# EAGLE design main (EAGLE 7.1.0)
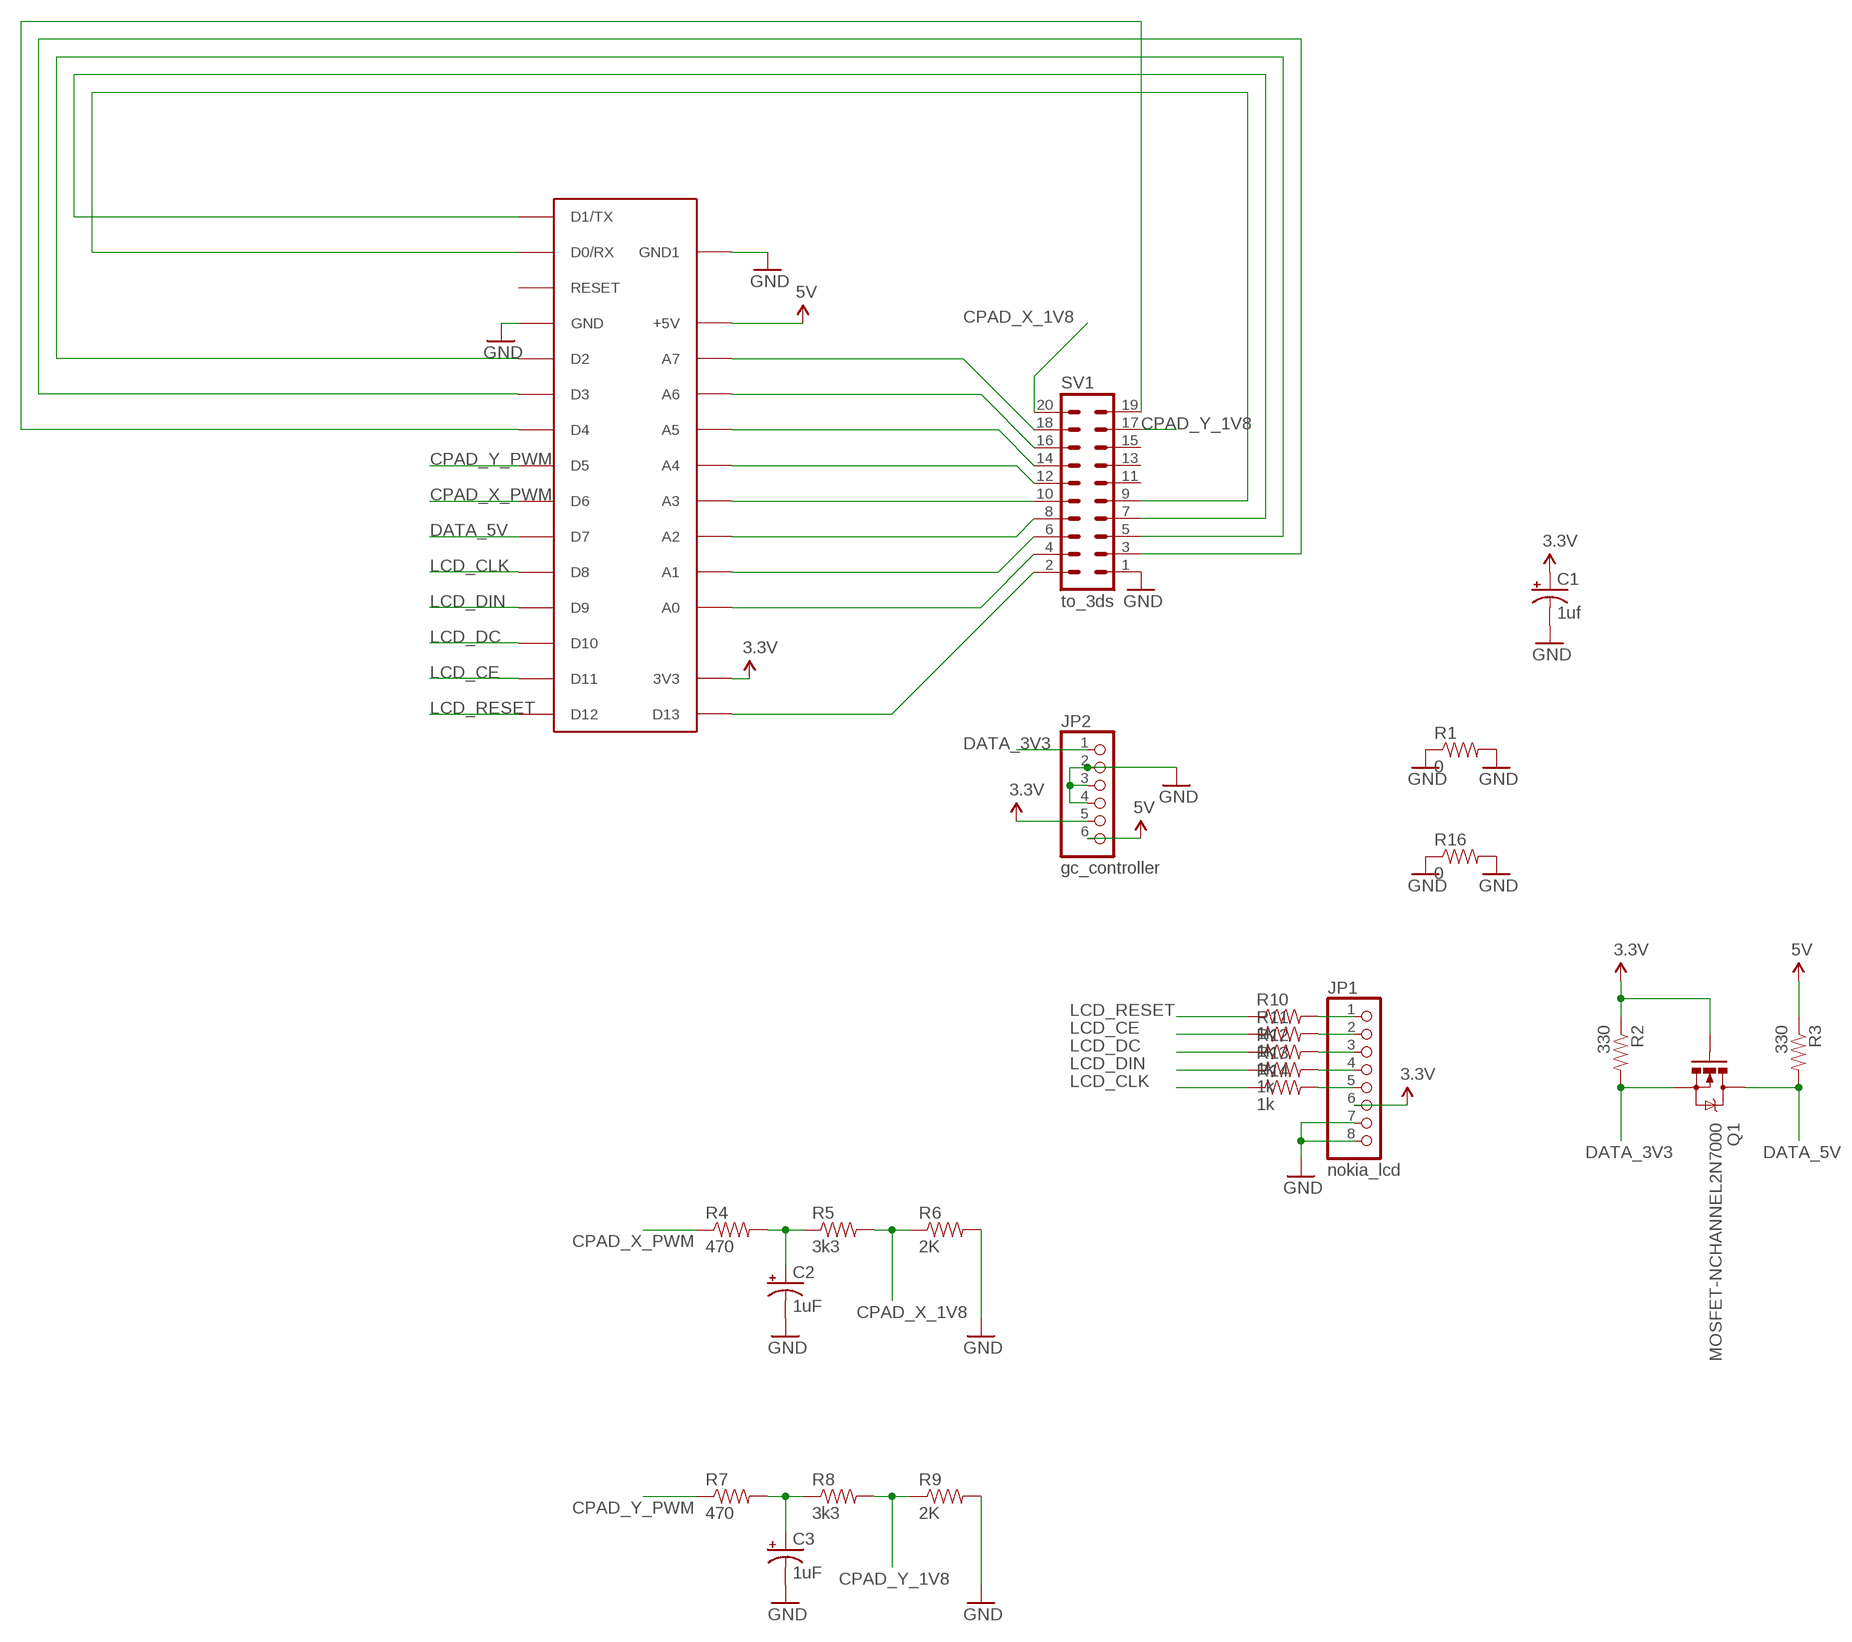
[diagram p0: schematic, sheet 1]

## Parts
C1  1uf  CAP_POLPTH2  [CPOL-RADIAL-10UF-25V]
C2  1uF  CAP_POLPTH2  [CPOL-RADIAL-10UF-25V]
C3  1uF  CAP_POLPTH2  [CPOL-RADIAL-10UF-25V]
JP1  nokia_lcd  PINHD-1X8CLEANBIG  [1X08-CLEANBIG]
JP2  gc_controller  PINHD-1X6  [1X06]
Q1  MOSFET-NCHANNEL2N7000  [TO-92]
R1  0  RESISTORPTH-1/4W  [AXIAL-0.4]
R2  330  RESISTORPTH-1/4W  [AXIAL-0.4]
R3  330  RESISTORPTH-1/4W  [AXIAL-0.4]
R4  470  RESISTORPTH-1/4W  [AXIAL-0.4]
R5  3k3  RESISTORPTH-1/4W  [AXIAL-0.4]
R6  2K  RESISTORPTH-1/4W  [AXIAL-0.4]
R7  470  RESISTORPTH-1/4W  [AXIAL-0.4]
R8  3k3  RESISTORPTH-1/4W  [AXIAL-0.4]
R9  2K  RESISTORPTH-1/4W  [AXIAL-0.4]
R10  1k  RESISTORPTH-1/4W  [AXIAL-0.4]
R11  1k  RESISTORPTH-1/4W  [AXIAL-0.4]
R12  1k  RESISTORPTH-1/4W  [AXIAL-0.4]
R13  1k  RESISTORPTH-1/4W  [AXIAL-0.4]
R14  1k  RESISTORPTH-1/4W  [AXIAL-0.4]
R16  0  RESISTORPTH-1/4W  [AXIAL-0.4]
SV1  to_3ds  MA10-2  [MA10-2]
U$1  ARDUINONANO  [PDIP-32]

## Nets
3.3V: C1.1(+) JP1.6 JP2.5 Q1.2(G) R2.P$1 U$1.3V3
5V: JP2.6 R3.P$1 U$1.+5V
CPAD_X_1V8: R5.P$2 R6.P$1 SV1.20
CPAD_X_PWM: R4.P$1 U$1.D6
CPAD_Y_1V8: R8.P$2 R9.P$1 SV1.17
CPAD_Y_PWM: R7.P$1 U$1.D5
DATA_3V3: JP2.1 Q1.1(S) R2.P$2
DATA_5V: Q1.3(D) R3.P$2 U$1.D7
GND: C1.2(-) C2.2(-) C3.2(-) JP1.7 JP1.8 JP2.2 JP2.3 JP2.4 R1.P$1 R1.P$2 R6.P$2 R9.P$2 R16.P$1 R16.P$2 SV1.1 U$1.GND U$1.GND1
LCD_CE: R11.P$1 U$1.D11
LCD_CLK: R14.P$1 U$1.D8
LCD_DC: R12.P$1 U$1.D10
LCD_DIN: R13.P$1 U$1.D9
LCD_RESET: R10.P$1 U$1.D12
N$1: C2.1(+) R4.P$2 R5.P$1
N$2: JP1.1 R10.P$2
N$3: JP1.2 R11.P$2
N$4: JP1.3 R12.P$2
N$5: C3.1(+) R7.P$2 R8.P$1
N$6: JP1.4 R13.P$2
N$7: JP1.5 R14.P$2
N$8: SV1.2 U$1.D13
N$9: SV1.4 U$1.A0
N$10: SV1.6 U$1.A1
N$11: SV1.8 U$1.A2
N$12: SV1.10 U$1.A3
N$13: SV1.12 U$1.A4
N$14: SV1.14 U$1.A5
N$15: SV1.16 U$1.A6
N$16: SV1.18 U$1.A7
N$18: SV1.19 U$1.D4
N$19: SV1.3 U$1.D3
N$20: SV1.5 U$1.D2
N$21: SV1.7 U$1.D1/TX
N$22: SV1.9 U$1.D0/RX
Unconnected: SV1.11 SV1.13 SV1.15 U$1.RESET

## Library data of the parts
C1-C3 = SparkFun-Capacitors:CAP_POL: Capacitor Polarized These are standard SMD and PTH capacitors. Normally 10uF, 47uF, and 100uF in electrolytic and tantalum varieties. Always verify the external diameter of the through hole cap, it varies with capacity, voltage, and manufacturer. The EIA devices should be standard.
JP1 = adafruit:PINHD-1X8: PIN HEADER
JP2 = adafruit:PINHD-1X6: PIN HEADER
Q1 = SparkFun-DiscreteSemi:MOSFET-NCHANNEL: Common NMOSFET Parts MFG P/N Store ID Prod ID FDD8780 TRANS-09984 SI7820DN TRANS-11055 FDS6630A IC-08089 2N7002PW TRANS-11151 FQP30N06L COM-10213 TRANS-10060 BSS123LT1G TRANS-08345 BSS138 TRANS-00830 BS170 2N7000
R1-R14 R16 = SparkFun-Resistors:RESISTOR: Resistor Basic schematic elements and footprints for 0603, 1206, and PTH resistors.
SV1 = con-lstb:MA10-2: PIN HEADER; OC_FARNELL: unknown; OC_NEWARK: unknown
U$1 = nano:ARDUINONANO

## Board
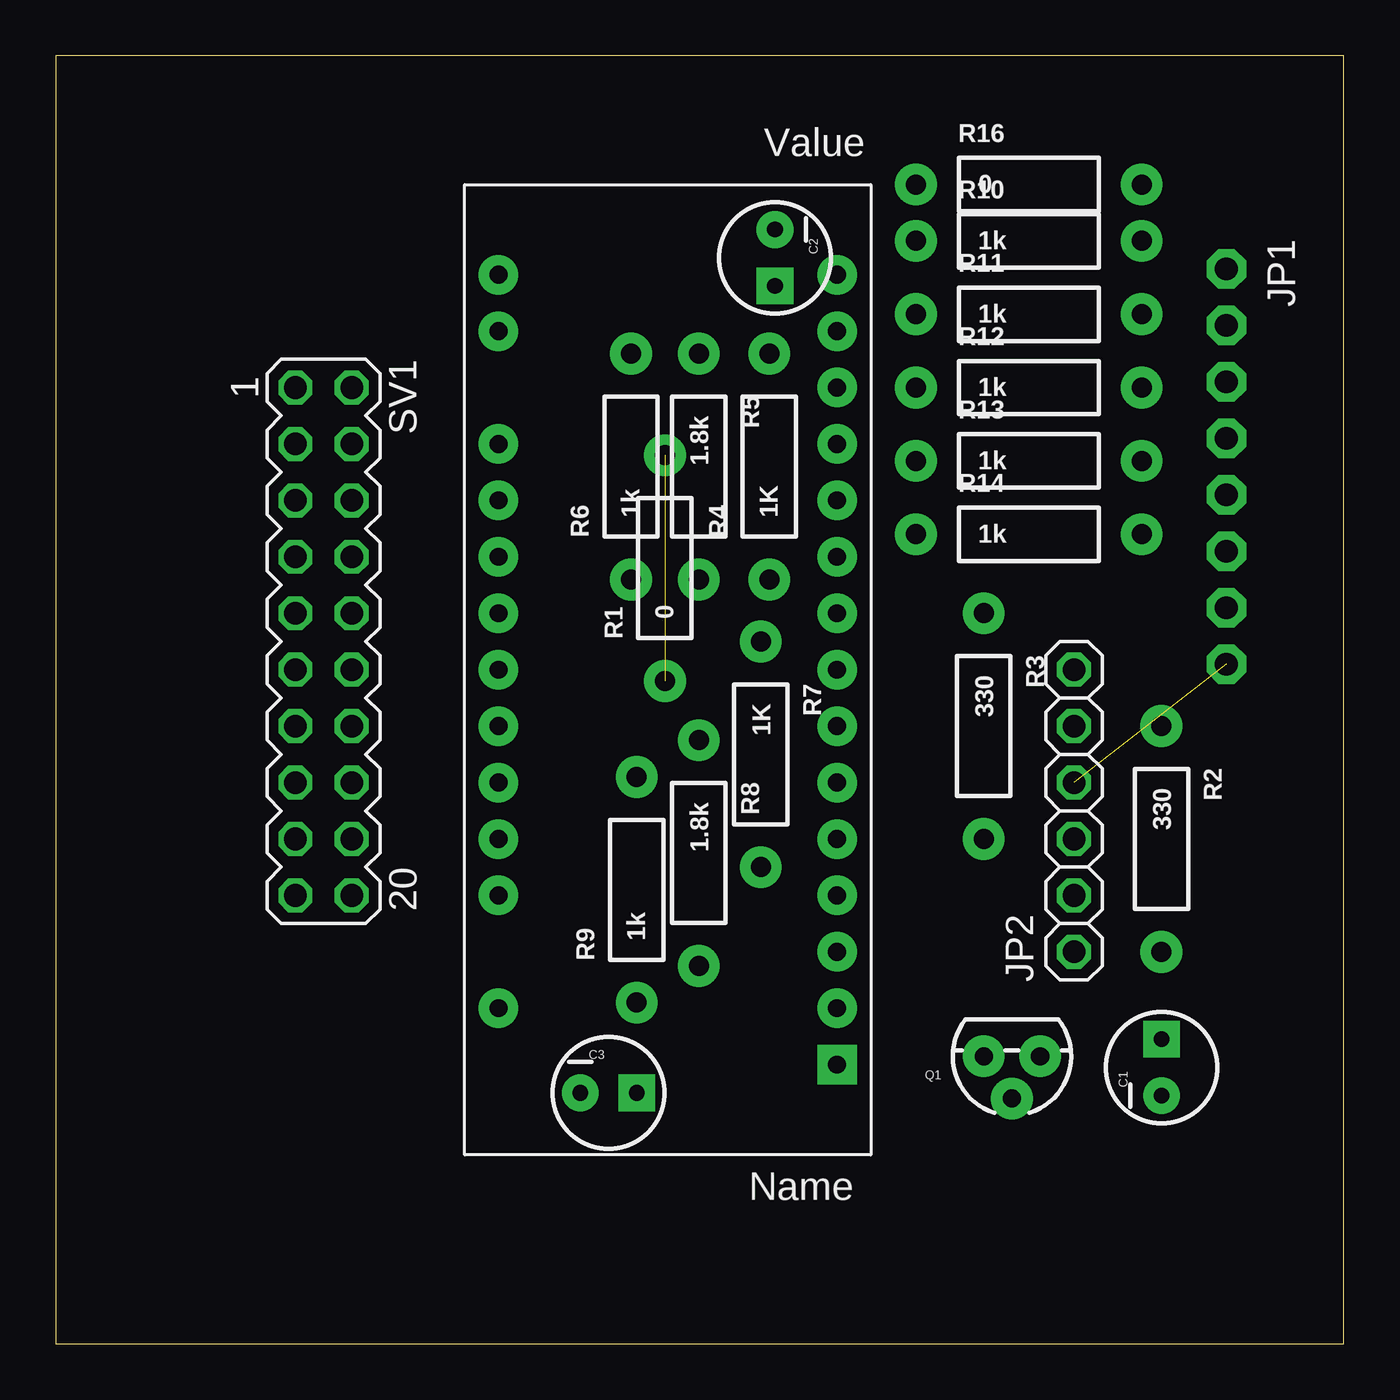
[diagram p1: board, top side]
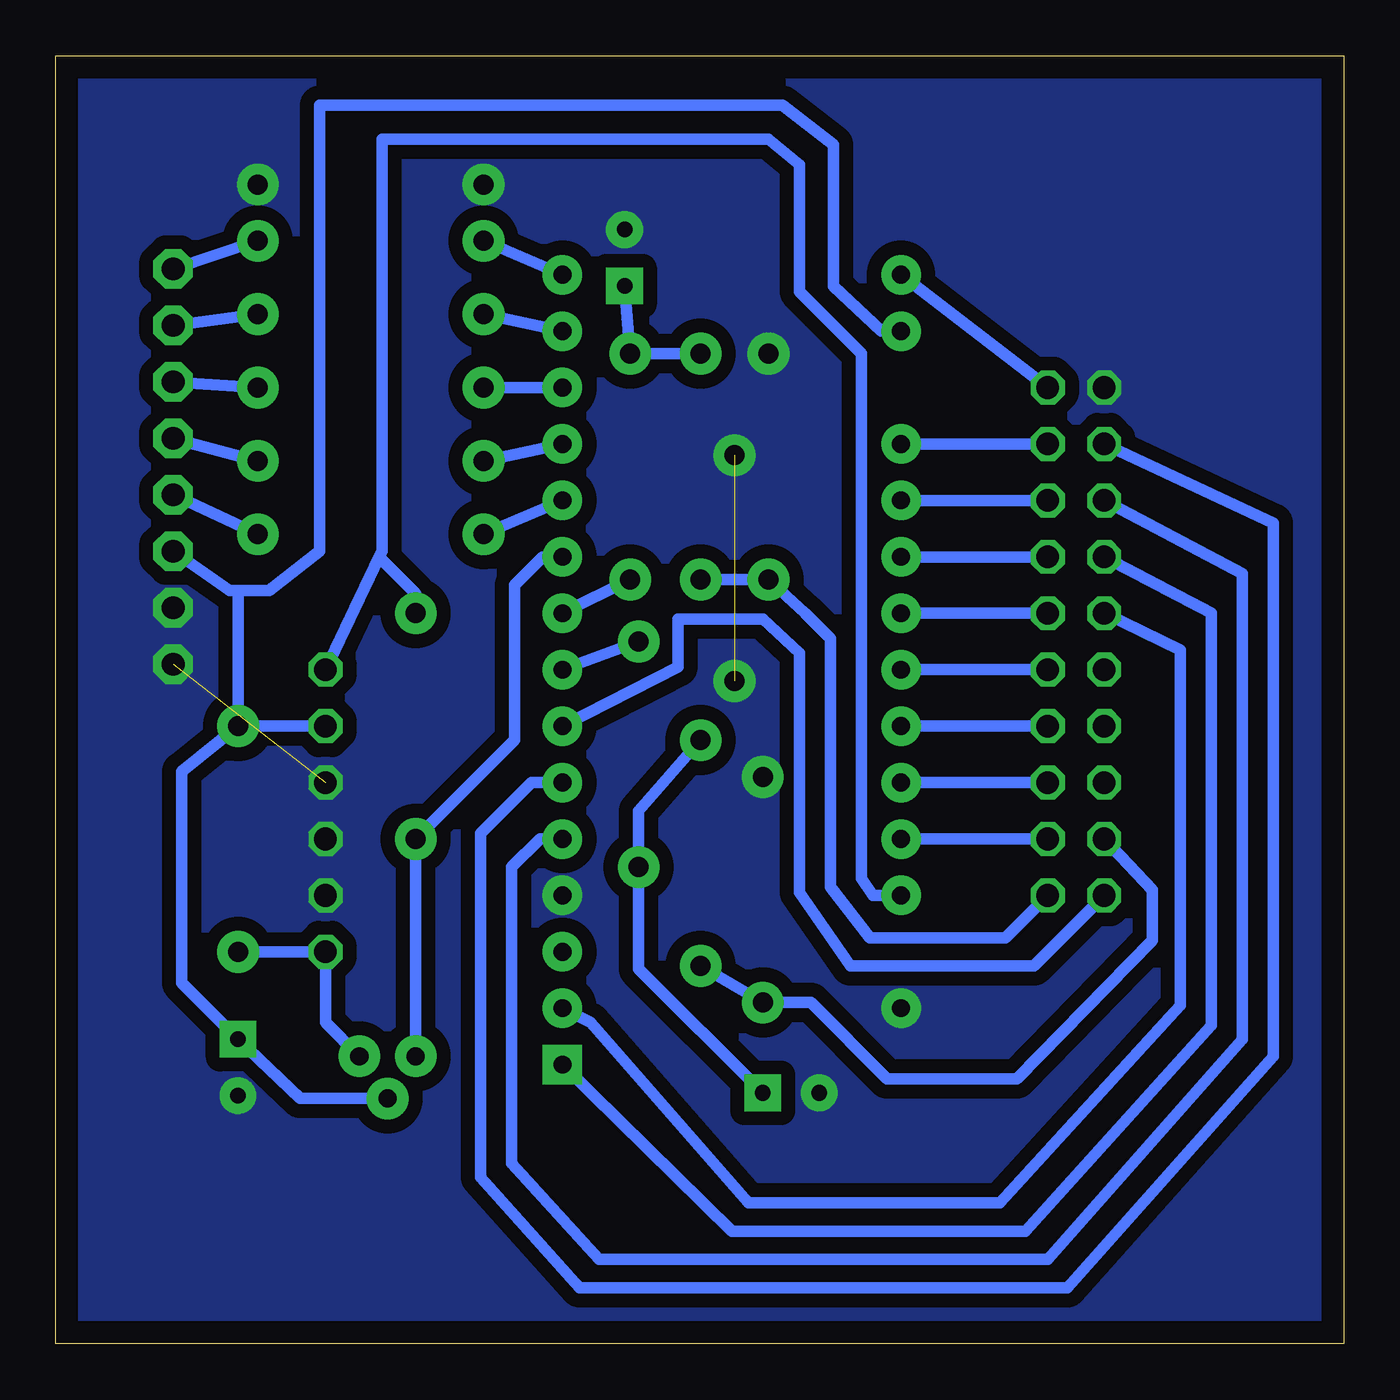
[diagram p2: board, bottom side, seen from below]

Size 58 x 58 mm. Coordinates in mm from the lower left corner, seen from the top.
Outline: 0,0 58,0 58,58 0,58 0,0
Copper layers (1*16): Top 0.035mm / dielectric 1.5mm / Bottom 0.035mm
Design rules "MWSEagleDesignRules2": minimum track width 13mil, minimum drill 22mil, track to track 13mil, track to pad 13mil, pad to pad 13mil, via to via 13mil, smd to smd 8mil, copper to edge 40mil, drill to drill 8mil, minimum pad ring 10mil, minimum via ring 8mil, stop-mask expansion 4mil, vias tented up to drill 0mil, thermal gap 10mil

### Footprints (pad centres in the part's own frame; a part is rotated, then mirrored left to right if it is on the bottom)
CPOL-RADIAL-10UF-25V = drill 0.7 pad 1.651 square: 1 1.27,0 | drill 0.7 pad 1.651: 2 -1.27,0
1X08-CLEANBIG = drill 1.016 pad 1.778 octagon: 1 -8.89,0; 2 -6.35,0; 3 -3.81,0; 4 -1.27,0; 5 1.27,0; 6 3.81,0; 7 6.35,0; 8 8.89,0
1X06 = drill 1.016 octagon: 1 -6.35,0; 2 -3.81,0; 3 -1.27,0; 4 1.27,0; 5 3.81,0; 6 6.35,0
TO-92 = drill 0.813 pad 1.88: 1 -1.27,0; 2 0,1.905; 3 1.27,0
AXIAL-0.4 = drill 0.9 pad 1.88: P$1 -5.08,0; P$2 5.08,0
MA10-2 = drill 1.016 octagon: 1 -11.43,-1.27; 2 -11.43,1.27; 3 -8.89,-1.27; 4 -8.89,1.27; 5 -6.35,-1.27; 6 -6.35,1.27; 7 -3.81,-1.27; 8 -3.81,1.27; 9 -1.27,-1.27; 10 -1.27,1.27; 11 1.27,-1.27; 12 1.27,1.27; 13 3.81,-1.27; 14 3.81,1.27; 15 6.35,-1.27; 16 6.35,1.27; 17 8.89,-1.27; 18 8.89,1.27; 19 11.43,-1.27; 20 11.43,1.27
PDIP-32 = drill 0.8 pad 1.778: 3V3 15.24,-35.56; +5V 15.24,-10.16; A0 15.24,-30.48; A1 15.24,-27.94; A2 15.24,-25.4; A3 15.24,-22.86; A4 15.24,-20.32; A5 15.24,-17.78; A6 15.24,-15.24; A7 15.24,-12.7; D0/RX 0,-5.08; D2 0,-12.7; D3 0,-15.24; D4 0,-17.78; D5 0,-20.32; D6 0,-22.86; D7 0,-25.4; D8 0,-27.94; D9 0,-30.48; D10 0,-33.02; D11 0,-35.56; D12 0,-38.1; D13 15.24,-38.1; GND 0,-10.16; GND1 15.24,-5.08; RESET 0,-7.62 | drill 0.8 pad 1.778 square: D1/TX 0,-2.54

### Placement (x,y rotation side)
C1  49.78,12.45 90 top
C2  32.38,48.9 270 top
C3  24.89,11.3 0 top
JP1  52.7,39.5 270 top
JP2  45.85,24 90 top
Q1  43.05,12.95 180 top
R1  27.43,34.92 90 top
R2  49.78,22.73 270 top
R3  41.78,27.81 270 top
R4  1K  [AXIAL-0.4]  32.13,39.5 90 top
R5  1.8k  [AXIAL-0.4]  28.96,39.5 270 top
R6  1k  [AXIAL-0.4]  25.91,39.5 90 top
R7  1K  [AXIAL-0.4]  31.75,26.54 270 top
R8  1.8k  [AXIAL-0.4]  28.96,22.1 270 top
R9  1k  [AXIAL-0.4]  26.16,20.45 90 top
R10  43.81,49.66 0 top
R11  43.81,46.35 0 top
R12  43.81,43.05 0 top
R13  43.81,39.75 0 top
R14  43.81,36.45 0 top
R16  43.81,52.2 0 top
SV1  12.06,31.62 270 top
U$1  35.18,10.03 180 top

### Tracks (layer width: path | path; a pad name or v marks a point on that pad's centre or on a via)
3.3V
  Bottom 0.508: U$1.3V3 20.83,45.59 22.99,47.62 22.99,53.98 25.27,55.75 46.1,55.75 46.1,35.69 48.39,33.91 49.78,33.91 | 49.78,33.91 50.16,33.91 JP1.6 | R2.P$1 49.78,33.91 | JP2.5 R2.P$1 | Q1.2 46.99,11.05 C1.1 52.32,16.26 52.32,25.78 R2.P$1
5V
  Bottom 0.508: U$1.+5V 21.21,20.19 21.72,20.95 21.72,44.58 24.51,47.37 24.51,53.09 25.91,54.23 43.31,54.23 43.31,35.69 43.43,35.42 | 43.43,35.42 JP2.6 | R3.P$1 41.78,33.77 43.43,35.42
CPAD_X_1V8
  Bottom 0.508: R5.P$2 R6.P$1 24.26,32.89 23.11,31.75 23.11,20.57 21.34,18.29 15.24,18.29 SV1.20
CPAD_X_PWM
  Bottom 0.508: R4.P$1 U$1.D6
CPAD_Y_1V8
  Bottom 0.508: R8.P$2 R9.P$1 24,15.37 20.57,11.94 14.73,11.94 8.64,18.16 8.64,20.45 SV1.17
CPAD_Y_PWM
  Bottom 0.508: R7.P$1 U$1.D5
DATA_3V3
  Bottom 0.508: R2.P$2 JP2.1 45.85,14.48 Q1.1
DATA_5V
  Bottom 0.508: Q1.3 R3.P$2 37.34,27.18 37.34,34.16 36.07,35.43 U$1.D7
GND  (2 unrouted)
  pour Bottom (isolate 0.635, no thermals): -0.25,58.17 0,0 58.29,-0.38 58.04,57.78
LCD_CE
  Bottom 0.508: U$1.D11 R11.P$1
LCD_CLK
  Bottom 0.508: U$1.D8 R14.P$1
LCD_DC
  Bottom 0.508: U$1.D10 R12.P$1
LCD_DIN
  Bottom 0.508: U$1.D9 R13.P$1
LCD_RESET
  Bottom 0.508: U$1.D12 R10.P$1
N$1
  Bottom 0.508: R5.P$1 R4.P$2 C2.1
N$2
  Bottom 0.508: R10.P$2 JP1.1
N$3
  Bottom 0.508: R11.P$2 JP1.2
N$4
  Bottom 0.508: R12.P$2 JP1.3
N$5
  Bottom 0.508: R8.P$1 31.75,24 R7.P$2 31.75,16.89 C3.1
N$6
  Bottom 0.508: R13.P$2 JP1.4
N$7
  Bottom 0.508: R14.P$2 JP1.5
N$8
  Bottom 0.508: SV1.2 U$1.D13
N$9
  Bottom 0.508: U$1.A0 SV1.4
N$10
  Bottom 0.508: U$1.A1 SV1.6
N$11
  Bottom 0.508: U$1.A2 SV1.8
N$12
  Bottom 0.508: U$1.A3 SV1.10
N$13
  Bottom 0.508: SV1.12 U$1.A4
N$14
  Bottom 0.508: SV1.14 U$1.A5
N$15
  Bottom 0.508: SV1.16 U$1.A6
N$16
  Bottom 0.508: SV1.18 U$1.A7
N$18
  Bottom 0.508: SV1.19 13.97,17.02 22.23,17.02 24.51,20.32 24.51,31.11 26.16,32.64 29.97,32.64 29.97,30.48 U$1.D4
N$19
  Bottom 0.508: U$1.D3 36.58,25.27 38.86,22.99 38.86,7.49 34.42,2.54 12.45,2.54 3.17,12.95 3.17,36.96 SV1.3
N$20
  Bottom 0.508: U$1.D2 36.2,22.73 37.47,21.46 37.47,8.13 33.53,3.81 13.34,3.81 4.57,13.72 4.57,34.67 SV1.5
N$21
  Bottom 0.508: U$1.D1/TX 27.56,5.08 14.35,5.08 5.97,14.35 5.97,32.89 SV1.7
N$22
  Bottom 0.508: SV1.9 7.37,31.24 7.37,15.24 15.49,6.35 26.8,6.35 33.91,14.48 U$1.D0/RX